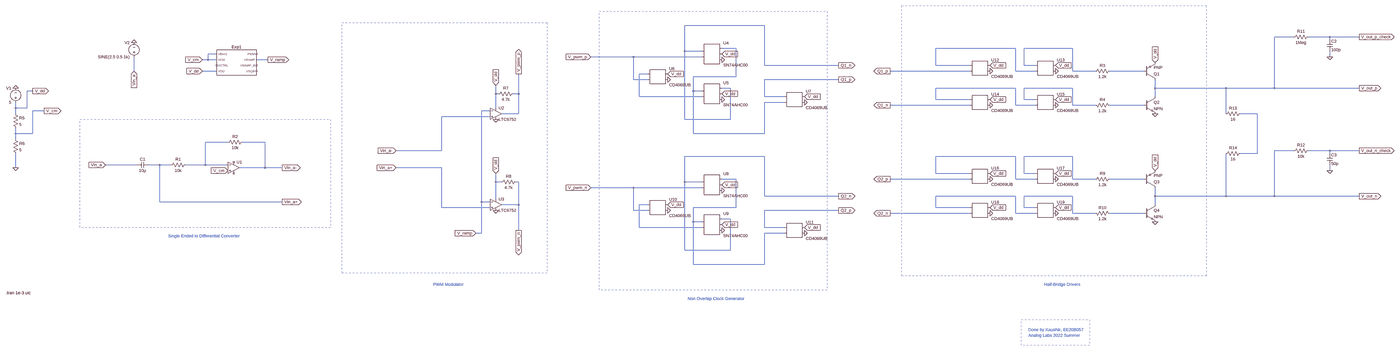
[diagram p0: schematic Exp_5_Simulation.asc, whole sheet]
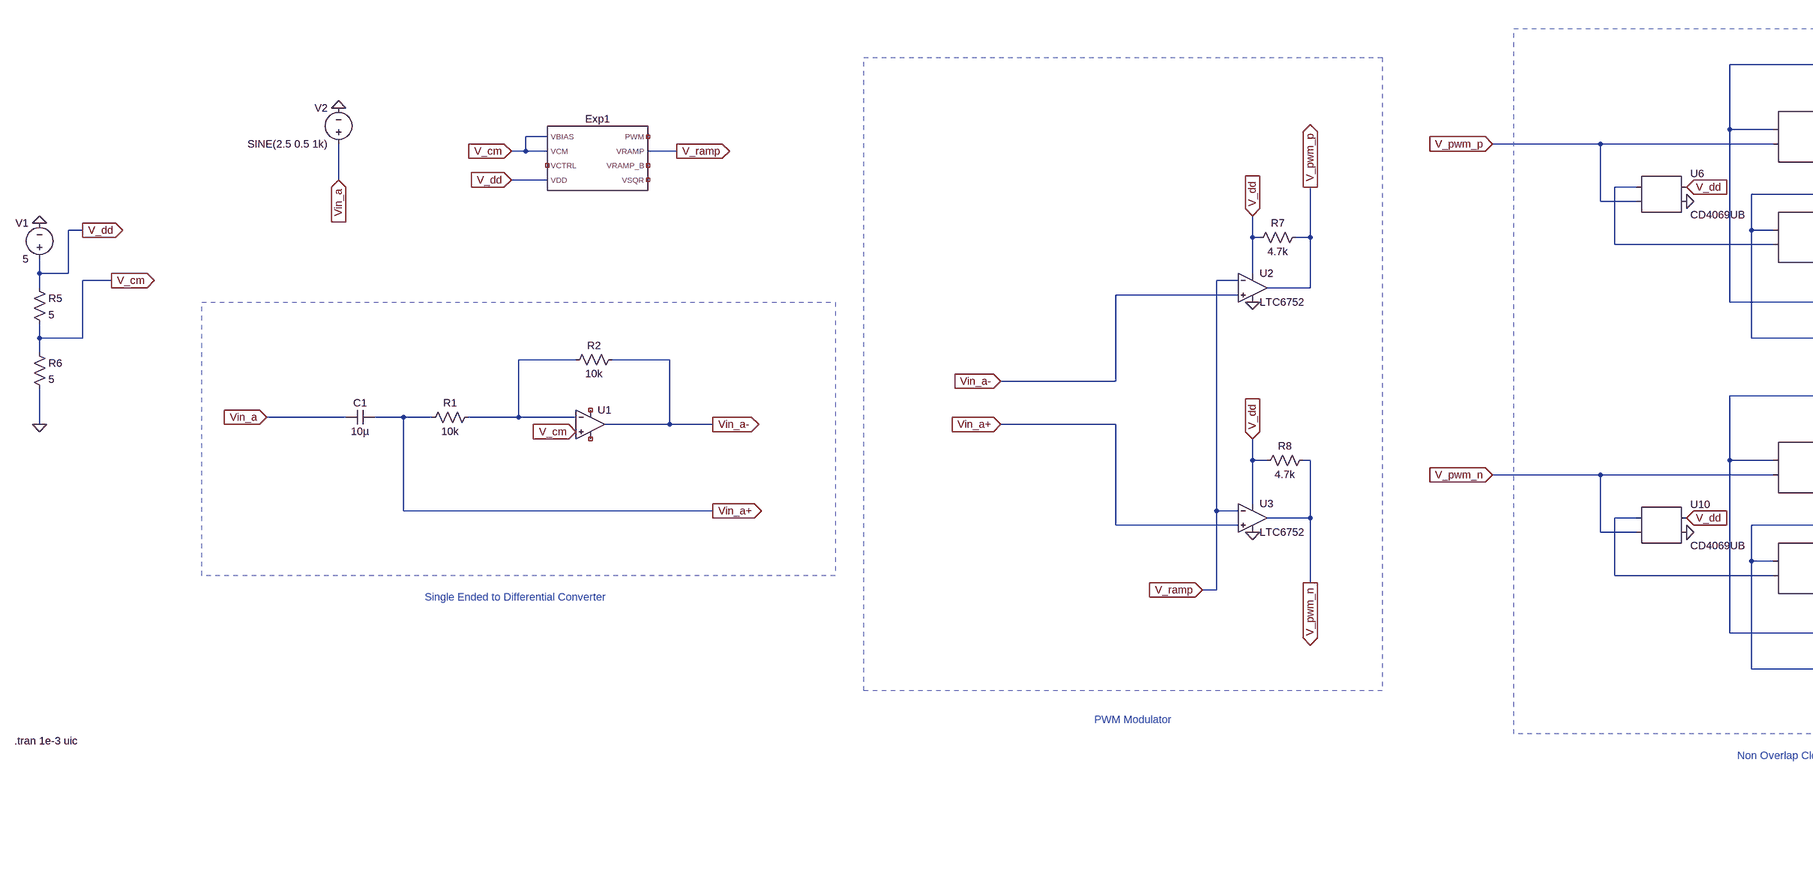
[diagram p1: schematic Exp_5_Simulation.asc, part, row 1 of 1, column 1 of 2]
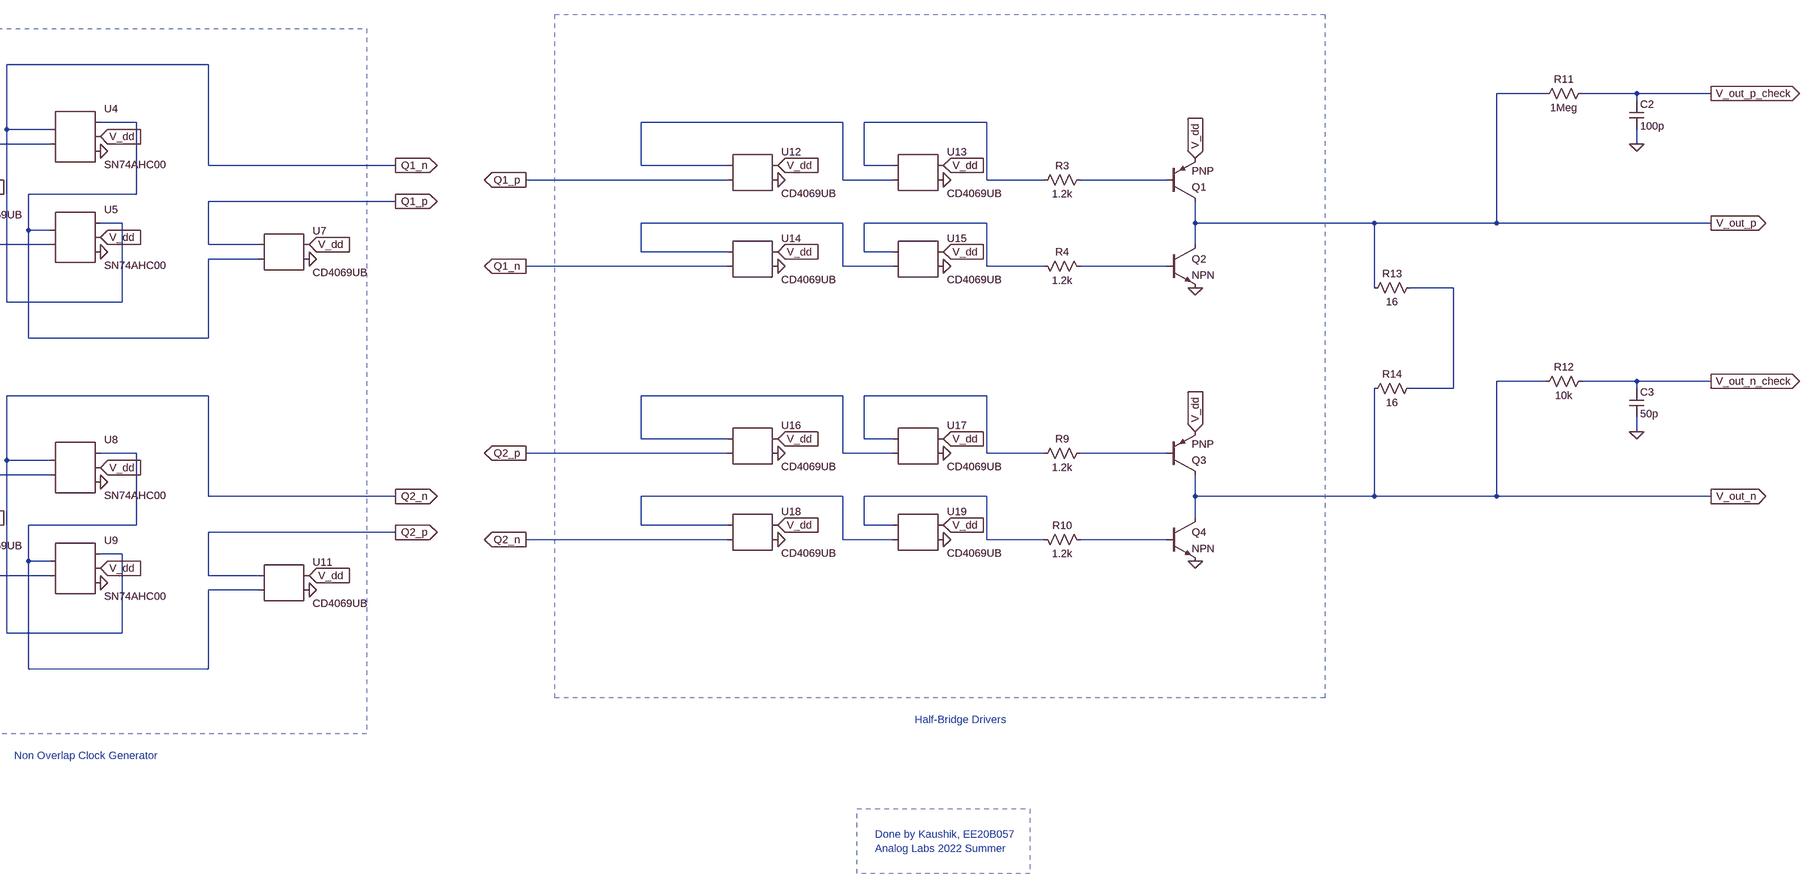
[diagram p2: schematic Exp_5_Simulation.asc, part, row 1 of 1, column 2 of 2]
Exp_5_Simulation.asc, the LTspice schematic file:
Version 4
SHEET 1 9068 1812
WIRE 5232 -256 4784 -256
WIRE 8400 -192 8272 -192
WIRE 8640 -192 8480 -192
WIRE 8832 -192 8640 -192
WIRE 8640 -176 8640 -192
WIRE 5072 -128 4992 -128
WIRE 6800 -128 6352 -128
WIRE 7120 -128 6848 -128
WIRE 4784 -112 4784 -256
WIRE 4880 -112 4784 -112
WIRE 2080 -96 2032 -96
WIRE 4496 -80 4256 -80
WIRE 4880 -80 4496 -80
WIRE 8640 -80 8640 -112
WIRE 2032 -64 2032 -96
WIRE 2032 -64 2000 -64
WIRE 2080 -64 2032 -64
WIRE 2368 -64 2304 -64
WIRE 5232 -32 5232 -256
WIRE 5648 -32 5232 -32
WIRE 6352 -32 6352 -128
WIRE 6544 -32 6352 -32
WIRE 6848 -32 6848 -128
WIRE 6912 -32 6848 -32
WIRE 1616 0 1616 -80
WIRE 2080 0 2000 0
WIRE 6544 0 6096 0
WIRE 6800 0 6800 -128
WIRE 6912 0 6800 0
WIRE 7120 0 7120 -128
WIRE 7248 0 7120 0
WIRE 7520 0 7328 0
WIRE 4576 16 4528 16
WIRE 5072 32 5072 -128
WIRE 5072 32 4832 32
WIRE 4496 48 4496 -80
WIRE 4576 48 4496 48
WIRE 5648 48 5232 48
WIRE 5040 96 4992 96
WIRE 6800 96 6352 96
WIRE 7120 96 6848 96
WIRE 7584 96 7584 48
WIRE 8000 96 7584 96
WIRE 8272 96 8272 -192
WIRE 8272 96 8000 96
WIRE 8832 96 8272 96
WIRE 1024 112 992 112
WIRE 4832 112 4832 32
WIRE 4880 112 4832 112
WIRE 3648 128 3648 80
WIRE 3664 128 3648 128
WIRE 3776 128 3776 16
WIRE 3776 128 3744 128
WIRE 4528 144 4528 16
WIRE 4880 144 4528 144
WIRE 5232 144 5232 48
WIRE 5344 144 5232 144
WIRE 7584 144 7584 96
WIRE 6352 160 6352 96
WIRE 6544 160 6352 160
WIRE 6848 160 6848 96
WIRE 6912 160 6848 160
WIRE 5344 176 5232 176
WIRE 6544 192 6096 192
WIRE 6800 192 6800 96
WIRE 6912 192 6800 192
WIRE 7120 192 7120 96
WIRE 7248 192 7120 192
WIRE 7520 192 7328 192
WIRE 928 208 928 176
WIRE 992 208 992 112
WIRE 992 208 928 208
WIRE 3648 208 3648 128
WIRE 1088 224 1024 224
WIRE 3616 224 3568 224
WIRE 928 240 928 208
WIRE 3776 240 3776 128
WIRE 3776 240 3680 240
WIRE 8000 240 8000 96
WIRE 8176 240 8080 240
WIRE 3616 256 3344 256
WIRE 4784 272 4784 -112
WIRE 5040 272 5040 96
WIRE 5040 272 4784 272
WIRE 928 352 928 320
WIRE 1024 352 1024 224
WIRE 1024 352 928 352
WIRE 4832 352 4832 112
WIRE 5232 352 5232 176
WIRE 5232 352 4832 352
WIRE 928 384 928 352
WIRE 2144 400 2016 400
WIRE 2352 400 2224 400
WIRE 3344 448 3344 256
WIRE 3344 448 3088 448
WIRE 8400 448 8272 448
WIRE 8640 448 8480 448
WIRE 8832 448 8640 448
WIRE 8176 464 8176 240
WIRE 8176 464 8080 464
WIRE 8640 464 8640 448
WIRE 5232 480 4784 480
WIRE 6800 480 6352 480
WIRE 7120 480 6848 480
WIRE 1632 528 1456 528
WIRE 1760 528 1696 528
WIRE 1824 528 1760 528
WIRE 2016 528 2016 400
WIRE 2016 528 1904 528
WIRE 2144 528 2016 528
WIRE 928 544 928 464
WIRE 2352 544 2352 400
WIRE 2352 544 2208 544
WIRE 2448 544 2352 544
WIRE 3344 544 3088 544
WIRE 8640 560 8640 528
WIRE 6352 576 6352 480
WIRE 6544 576 6352 576
WIRE 6848 576 6848 480
WIRE 6912 576 6848 576
WIRE 5072 608 4992 608
WIRE 6544 608 6096 608
WIRE 6800 608 6800 480
WIRE 6912 608 6800 608
WIRE 7120 608 7120 480
WIRE 7248 608 7120 608
WIRE 7520 608 7328 608
WIRE 3648 624 3648 576
WIRE 3680 624 3648 624
WIRE 3776 624 3760 624
WIRE 4784 624 4784 480
WIRE 4880 624 4784 624
WIRE 4496 656 4256 656
WIRE 4880 656 4496 656
WIRE 5232 704 5232 480
WIRE 5648 704 5232 704
WIRE 6800 704 6352 704
WIRE 7120 704 6848 704
WIRE 7584 704 7584 656
WIRE 8000 704 8000 464
WIRE 8000 704 7584 704
WIRE 8272 704 8272 448
WIRE 8272 704 8000 704
WIRE 8832 704 8272 704
WIRE 3648 720 3648 624
WIRE 1760 736 1760 528
WIRE 2448 736 1760 736
WIRE 3568 736 3568 224
WIRE 3616 736 3568 736
WIRE 3776 752 3776 624
WIRE 3776 752 3680 752
WIRE 4576 752 4528 752
WIRE 7584 752 7584 704
WIRE 3344 768 3344 544
WIRE 3616 768 3344 768
WIRE 5072 768 5072 608
WIRE 5072 768 4832 768
WIRE 6352 768 6352 704
WIRE 6544 768 6352 768
WIRE 6848 768 6848 704
WIRE 6912 768 6848 768
WIRE 4496 784 4496 656
WIRE 4576 784 4496 784
WIRE 5648 784 5232 784
WIRE 6544 800 6096 800
WIRE 6800 800 6800 704
WIRE 6912 800 6800 800
WIRE 7120 800 7120 704
WIRE 7248 800 7120 800
WIRE 7520 800 7328 800
WIRE 5040 832 4992 832
WIRE 4832 848 4832 768
WIRE 4880 848 4832 848
WIRE 4528 880 4528 752
WIRE 4880 880 4528 880
WIRE 5232 880 5232 784
WIRE 5344 880 5232 880
WIRE 3776 896 3776 752
WIRE 3568 912 3568 736
WIRE 3568 912 3536 912
WIRE 5344 912 5232 912
WIRE 4784 1008 4784 624
WIRE 5040 1008 5040 832
WIRE 5040 1008 4784 1008
WIRE 4832 1088 4832 848
WIRE 5232 1088 5232 912
WIRE 5232 1088 4832 1088
FLAG 1456 528 Vin_a
IOPIN 1456 528 In
FLAG 2448 544 Vin_a-
IOPIN 2448 544 Out
FLAG 2448 736 Vin_a+
IOPIN 2448 736 Out
FLAG 3536 912 V_ramp
IOPIN 3536 912 In
FLAG 3088 448 Vin_a-
IOPIN 3088 448 In
FLAG 3088 544 Vin_a+
IOPIN 3088 544 In
FLAG 3776 16 V_pwm_p
IOPIN 3776 16 Out
FLAG 3776 896 V_pwm_n
IOPIN 3776 896 Out
FLAG 928 96 0
FLAG 928 544 0
FLAG 1088 224 V_cm
IOPIN 1088 224 Out
FLAG 2000 -64 V_cm
IOPIN 2000 -64 In
FLAG 1024 112 V_dd
IOPIN 1024 112 Out
FLAG 2000 0 V_dd
IOPIN 2000 0 In
FLAG 3648 80 V_dd
IOPIN 3648 80 In
FLAG 3648 576 V_dd
IOPIN 3648 576 In
FLAG 3648 272 0
FLAG 3648 784 0
FLAG 2368 -64 V_ramp
IOPIN 2368 -64 Out
FLAG 1616 -160 0
FLAG 1616 0 Vin_a
IOPIN 1616 0 In
FLAG 2144 560 V_cm
IOPIN 2144 560 In
FLAG 4992 -96 V_dd
IOPIN 4992 -96 In
FLAG 4992 128 V_dd
IOPIN 4992 128 In
FLAG 4992 -64 0
FLAG 4992 160 0
FLAG 4256 -80 V_pwm_p
IOPIN 4256 -80 In
FLAG 5648 -32 Q1_n
IOPIN 5648 -32 Out
FLAG 5648 48 Q1_p
IOPIN 5648 48 Out
FLAG 5456 144 V_dd
IOPIN 5456 144 In
FLAG 5456 176 0
FLAG 4992 640 V_dd
IOPIN 4992 640 In
FLAG 4992 864 V_dd
IOPIN 4992 864 In
FLAG 4992 672 0
FLAG 4992 896 0
FLAG 4256 656 V_pwm_n
IOPIN 4256 656 In
FLAG 5648 704 Q2_n
IOPIN 5648 704 Out
FLAG 5648 784 Q2_p
IOPIN 5648 784 Out
FLAG 5456 880 V_dd
IOPIN 5456 880 In
FLAG 5456 912 0
FLAG 4688 16 V_dd
IOPIN 4688 16 In
FLAG 4688 752 V_dd
IOPIN 4688 752 In
FLAG 4688 48 0
FLAG 4688 784 0
FLAG 6656 -32 V_dd
IOPIN 6656 -32 In
FLAG 6656 160 V_dd
IOPIN 6656 160 In
FLAG 7024 -32 V_dd
IOPIN 7024 -32 In
FLAG 7024 160 V_dd
IOPIN 7024 160 In
FLAG 6656 0 0
FLAG 6656 192 0
FLAG 7024 0 0
FLAG 7024 192 0
FLAG 7584 -48 V_dd
IOPIN 7584 -48 In
FLAG 7584 240 0
FLAG 6096 0 Q1_p
IOPIN 6096 0 Out
FLAG 6096 192 Q1_n
IOPIN 6096 192 Out
FLAG 8832 96 V_out_p
IOPIN 8832 96 Out
FLAG 6656 576 V_dd
IOPIN 6656 576 In
FLAG 6656 768 V_dd
IOPIN 6656 768 In
FLAG 7024 576 V_dd
IOPIN 7024 576 In
FLAG 7024 768 V_dd
IOPIN 7024 768 In
FLAG 6656 608 0
FLAG 6656 800 0
FLAG 7024 608 0
FLAG 7024 800 0
FLAG 7584 560 V_dd
IOPIN 7584 560 In
FLAG 7584 848 0
FLAG 6096 608 Q2_p
IOPIN 6096 608 Out
FLAG 6096 800 Q2_n
IOPIN 6096 800 Out
FLAG 8832 704 V_out_n
IOPIN 8832 704 Out
FLAG 8640 -80 0
FLAG 8832 -192 V_out_p_check
IOPIN 8832 -192 Out
FLAG 8640 560 0
FLAG 8832 448 V_out_n_check
IOPIN 8832 448 Out
SYMBOL cap 1696 512 R90
WINDOW 0 0 32 VBottom 2
WINDOW 3 32 32 VTop 2
SYMATTR InstName C1
SYMATTR Value 10µ
SYMBOL res 1920 512 R90
WINDOW 0 0 56 VBottom 2
WINDOW 3 32 56 VTop 2
SYMATTR InstName R1
SYMATTR Value 10k
SYMBOL res 2240 384 R90
WINDOW 0 0 56 VBottom 2
WINDOW 3 32 56 VTop 2
SYMATTR InstName R2
SYMATTR Value 10k
SYMBOL OpAmps\\UniversalOpAmp 2176 544 R0
SYMATTR InstName U1
SYMBOL Comparators\\LTC6752 3648 176 R0
SYMATTR InstName U2
SYMBOL Comparators\\LTC6752 3648 688 R0
SYMATTR InstName U3
SYMBOL Exp_1_block 2192 -48 R0
SYMATTR InstName Exp1
SYMBOL voltage 928 192 R180
WINDOW 0 24 96 Left 2
WINDOW 3 24 16 Left 2
WINDOW 123 0 0 Left 0
WINDOW 39 0 0 Left 0
SYMATTR InstName V1
SYMATTR Value 5
SYMBOL res 912 224 R0
SYMATTR InstName R5
SYMATTR Value 5
SYMBOL res 912 368 R0
SYMATTR InstName R6
SYMATTR Value 5
SYMBOL res 3760 112 R90
WINDOW 0 0 56 VBottom 2
WINDOW 3 32 56 VTop 2
SYMATTR InstName R7
SYMATTR Value 4.7k
SYMBOL res 3776 608 R90
WINDOW 0 0 56 VBottom 2
WINDOW 3 32 56 VTop 2
SYMATTR InstName R8
SYMATTR Value 4.7k
SYMBOL voltage 1616 -64 R180
WINDOW 0 24 96 Left 2
WINDOW 3 24 16 Left 2
WINDOW 123 0 0 Left 0
WINDOW 39 0 0 Left 0
SYMATTR InstName V2
SYMATTR Value SINE(2.5 0.5 1k)
SYMBOL AutoGenerated\\SN74AHC00 4928 -96 R0
SYMATTR InstName U4
SYMBOL AutoGenerated\\SN74AHC00 4928 128 R0
SYMATTR InstName U5
SYMBOL AutoGenerated\\CD4069UB 4624 32 R0
SYMATTR InstName U6
SYMBOL AutoGenerated\\CD4069UB 5392 160 R0
SYMATTR InstName U7
SYMBOL AutoGenerated\\SN74AHC00 4928 640 R0
SYMATTR InstName U8
SYMBOL AutoGenerated\\SN74AHC00 4928 864 R0
SYMATTR InstName U9
SYMBOL AutoGenerated\\CD4069UB 4624 768 R0
SYMATTR InstName U10
SYMBOL AutoGenerated\\CD4069UB 5392 896 R0
SYMATTR InstName U11
SYMBOL AutoGenerated\\CD4069UB 6592 -16 R0
SYMATTR InstName U12
SYMBOL AutoGenerated\\CD4069UB 6960 -16 R0
SYMATTR InstName U13
SYMBOL AutoGenerated\\CD4069UB 6592 176 R0
SYMATTR InstName U14
SYMBOL AutoGenerated\\CD4069UB 6960 176 R0
SYMATTR InstName U15
SYMBOL res 7344 -16 R90
WINDOW 0 0 56 VBottom 2
WINDOW 3 32 56 VTop 2
SYMATTR InstName R3
SYMATTR Value 1.2k
SYMBOL pnp 7520 48 M180
SYMATTR InstName Q1
SYMBOL res 7232 176 M90
WINDOW 0 0 56 VBottom 2
WINDOW 3 32 56 VTop 2
SYMATTR InstName R4
SYMATTR Value 1.2k
SYMBOL npn 7520 144 R0
SYMATTR InstName Q2
SYMBOL AutoGenerated\\CD4069UB 6592 592 R0
SYMATTR InstName U16
SYMBOL AutoGenerated\\CD4069UB 6960 592 R0
SYMATTR InstName U17
SYMBOL AutoGenerated\\CD4069UB 6592 784 R0
SYMATTR InstName U18
SYMBOL AutoGenerated\\CD4069UB 6960 784 R0
SYMATTR InstName U19
SYMBOL res 7344 592 R90
WINDOW 0 0 56 VBottom 2
WINDOW 3 32 56 VTop 2
SYMATTR InstName R9
SYMATTR Value 1.2k
SYMBOL pnp 7520 656 M180
SYMATTR InstName Q3
SYMBOL res 7232 784 M90
WINDOW 0 0 56 VBottom 2
WINDOW 3 32 56 VTop 2
SYMATTR InstName R10
SYMATTR Value 1.2k
SYMBOL npn 7520 752 R0
SYMATTR InstName Q4
SYMBOL res 8496 -208 R90
WINDOW 0 0 56 VBottom 2
WINDOW 3 32 56 VTop 2
SYMATTR InstName R11
SYMATTR Value 1Meg
SYMBOL cap 8624 -176 R0
SYMATTR InstName C2
SYMATTR Value 100p
SYMBOL res 8496 432 R90
WINDOW 0 0 56 VBottom 2
WINDOW 3 32 56 VTop 2
SYMATTR InstName R12
SYMATTR Value 10k
SYMBOL cap 8624 464 R0
SYMATTR InstName C3
SYMATTR Value 50p
SYMBOL res 8096 224 R90
WINDOW 0 0 56 VBottom 2
WINDOW 3 32 56 VTop 2
SYMATTR InstName R13
SYMATTR Value 16
SYMBOL res 8096 448 R90
WINDOW 0 0 56 VBottom 2
WINDOW 3 32 56 VTop 2
SYMATTR InstName R14
SYMATTR Value 16
TEXT 1808 928 Left 2 ;Single Ended to Differential Converter
TEXT 3296 1200 Left 2 ;PWM Modulator
TEXT 872 1248 Left 2 !.tran 1e-3 uic
TEXT 6872 1720 Left 2 ;Done by Kaushik, EE20B057
TEXT 6872 1752 Left 2 ;Analog Labs 2022 Summer
TEXT 4800 1280 Left 2 ;Non Overlap Clock Generator
TEXT 6960 1200 Left 2 ;Half-Bridge Drivers
RECTANGLE Normal 2720 880 1312 272 2
RECTANGLE Normal 3936 1136 2784 -272 2
RECTANGLE Normal 7216 1808 6832 1664 2
RECTANGLE Normal 5584 1232 4304 -336 2
RECTANGLE Normal 7872 1152 6160 -368 2

The netlist it stands for:
* Exp_5_Simulation.asc
C1 Vin_a+ Vin_a 10µ
R1 N010 Vin_a+ 10k
R2 Vin_a- N010 10k
XU1 V_cm N010 NC_01 NC_02 Vin_a- level1 Avol=1Meg GBW=10Meg Vos=0 En=0 Enk=0 In=0 Ink=0 Rin=500Meg  ; pins In+ In- V+ V- OUT
XU2 Vin_a- V_ramp V_dd 0 V_pwm_p LTC6752  ; pins In+ In- V+ V- OUT
XU3 Vin_a+ V_ramp V_dd 0 V_pwm_n LTC6752  ; pins In+ In- V+ V- OUT
XExp1 V_cm V_cm NC_03 V_dd NC_04 V_ramp NC_05 NC_06 Exp_1_block  ; pins VBIAS VCM VCTRL VDD PWM VRAMP VRAMP_B VSQR
V1 V_dd 0 5
R5 V_dd V_cm 5
R6 V_cm 0 5
R7 V_pwm_p V_dd 4.7k
R8 V_pwm_n V_dd 4.7k
V2 Vin_a 0 SINE(2.5 0.5 1k)
* U4: SN74AHC00 (symbol AutoGenerated\SN74AHC00 not available, pins judged from their places): pin1=Q1_n pin2=V_pwm_p pin3=N001 pin4=V_dd pin5=0
* U5: SN74AHC00 (symbol AutoGenerated\SN74AHC00 not available, pins judged from their places): pin1=N001 pin2=N005 pin3=Q1_n pin4=V_dd pin5=0
* U6: CD4069UB (symbol AutoGenerated\CD4069UB not available, pins judged from their places): pin1=N005 pin2=V_pwm_p pin3=V_dd pin4=0
* U7: CD4069UB (symbol AutoGenerated\CD4069UB not available, pins judged from their places): pin1=Q1_p pin2=N001 pin3=V_dd pin4=0
* U8: SN74AHC00 (symbol AutoGenerated\SN74AHC00 not available, pins judged from their places): pin1=Q2_n pin2=V_pwm_n pin3=N013 pin4=V_dd pin5=0
* U9: SN74AHC00 (symbol AutoGenerated\SN74AHC00 not available, pins judged from their places): pin1=N013 pin2=N017 pin3=Q2_n pin4=V_dd pin5=0
* U10: CD4069UB (symbol AutoGenerated\CD4069UB not available, pins judged from their places): pin1=N017 pin2=V_pwm_n pin3=V_dd pin4=0
* U11: CD4069UB (symbol AutoGenerated\CD4069UB not available, pins judged from their places): pin1=Q2_p pin2=N013 pin3=V_dd pin4=0
* U12: CD4069UB (symbol AutoGenerated\CD4069UB not available, pins judged from their places): pin1=N002 pin2=Q1_p pin3=V_dd pin4=0
* U13: CD4069UB (symbol AutoGenerated\CD4069UB not available, pins judged from their places): pin1=N003 pin2=N002 pin3=V_dd pin4=0
* U14: CD4069UB (symbol AutoGenerated\CD4069UB not available, pins judged from their places): pin1=N006 pin2=Q1_n pin3=V_dd pin4=0
* U15: CD4069UB (symbol AutoGenerated\CD4069UB not available, pins judged from their places): pin1=N007 pin2=N006 pin3=V_dd pin4=0
R3 N004 N003 1.2k
Q1 V_out_p N004 V_dd 0 PNP
R4 N007 N008 1.2k
Q2 V_out_p N008 0 0 NPN
* U16: CD4069UB (symbol AutoGenerated\CD4069UB not available, pins judged from their places): pin1=N011 pin2=Q2_p pin3=V_dd pin4=0
* U17: CD4069UB (symbol AutoGenerated\CD4069UB not available, pins judged from their places): pin1=N012 pin2=N011 pin3=V_dd pin4=0
* U18: CD4069UB (symbol AutoGenerated\CD4069UB not available, pins judged from their places): pin1=N015 pin2=Q2_n pin3=V_dd pin4=0
* U19: CD4069UB (symbol AutoGenerated\CD4069UB not available, pins judged from their places): pin1=N016 pin2=N015 pin3=V_dd pin4=0
R9 N014 N012 1.2k
Q3 V_out_n N014 V_dd 0 PNP
R10 N016 N018 1.2k
Q4 V_out_n N018 0 0 NPN
R11 V_out_p_check V_out_p 1Meg
C2 V_out_p_check 0 100p
R12 V_out_n_check V_out_n 10k
C3 V_out_n_check 0 50p
R13 N009 V_out_p 16
R14 N009 V_out_n 16
.model NPN NPN
.model PNP PNP
.lib standard.bjt
* Single Ended to Differential Converter
* PWM Modulator
.tran 1e-3 uic
* Done by Kaushik, EE20B057
* Analog Labs 2022 Summer
* Non Overlap Clock Generator
* Half-Bridge Drivers
.lib UniversalOpAmp1.lib
.lib LTC7.lib
.backanno
.end